# Altium project ctrl_V1.0.PrjPcb
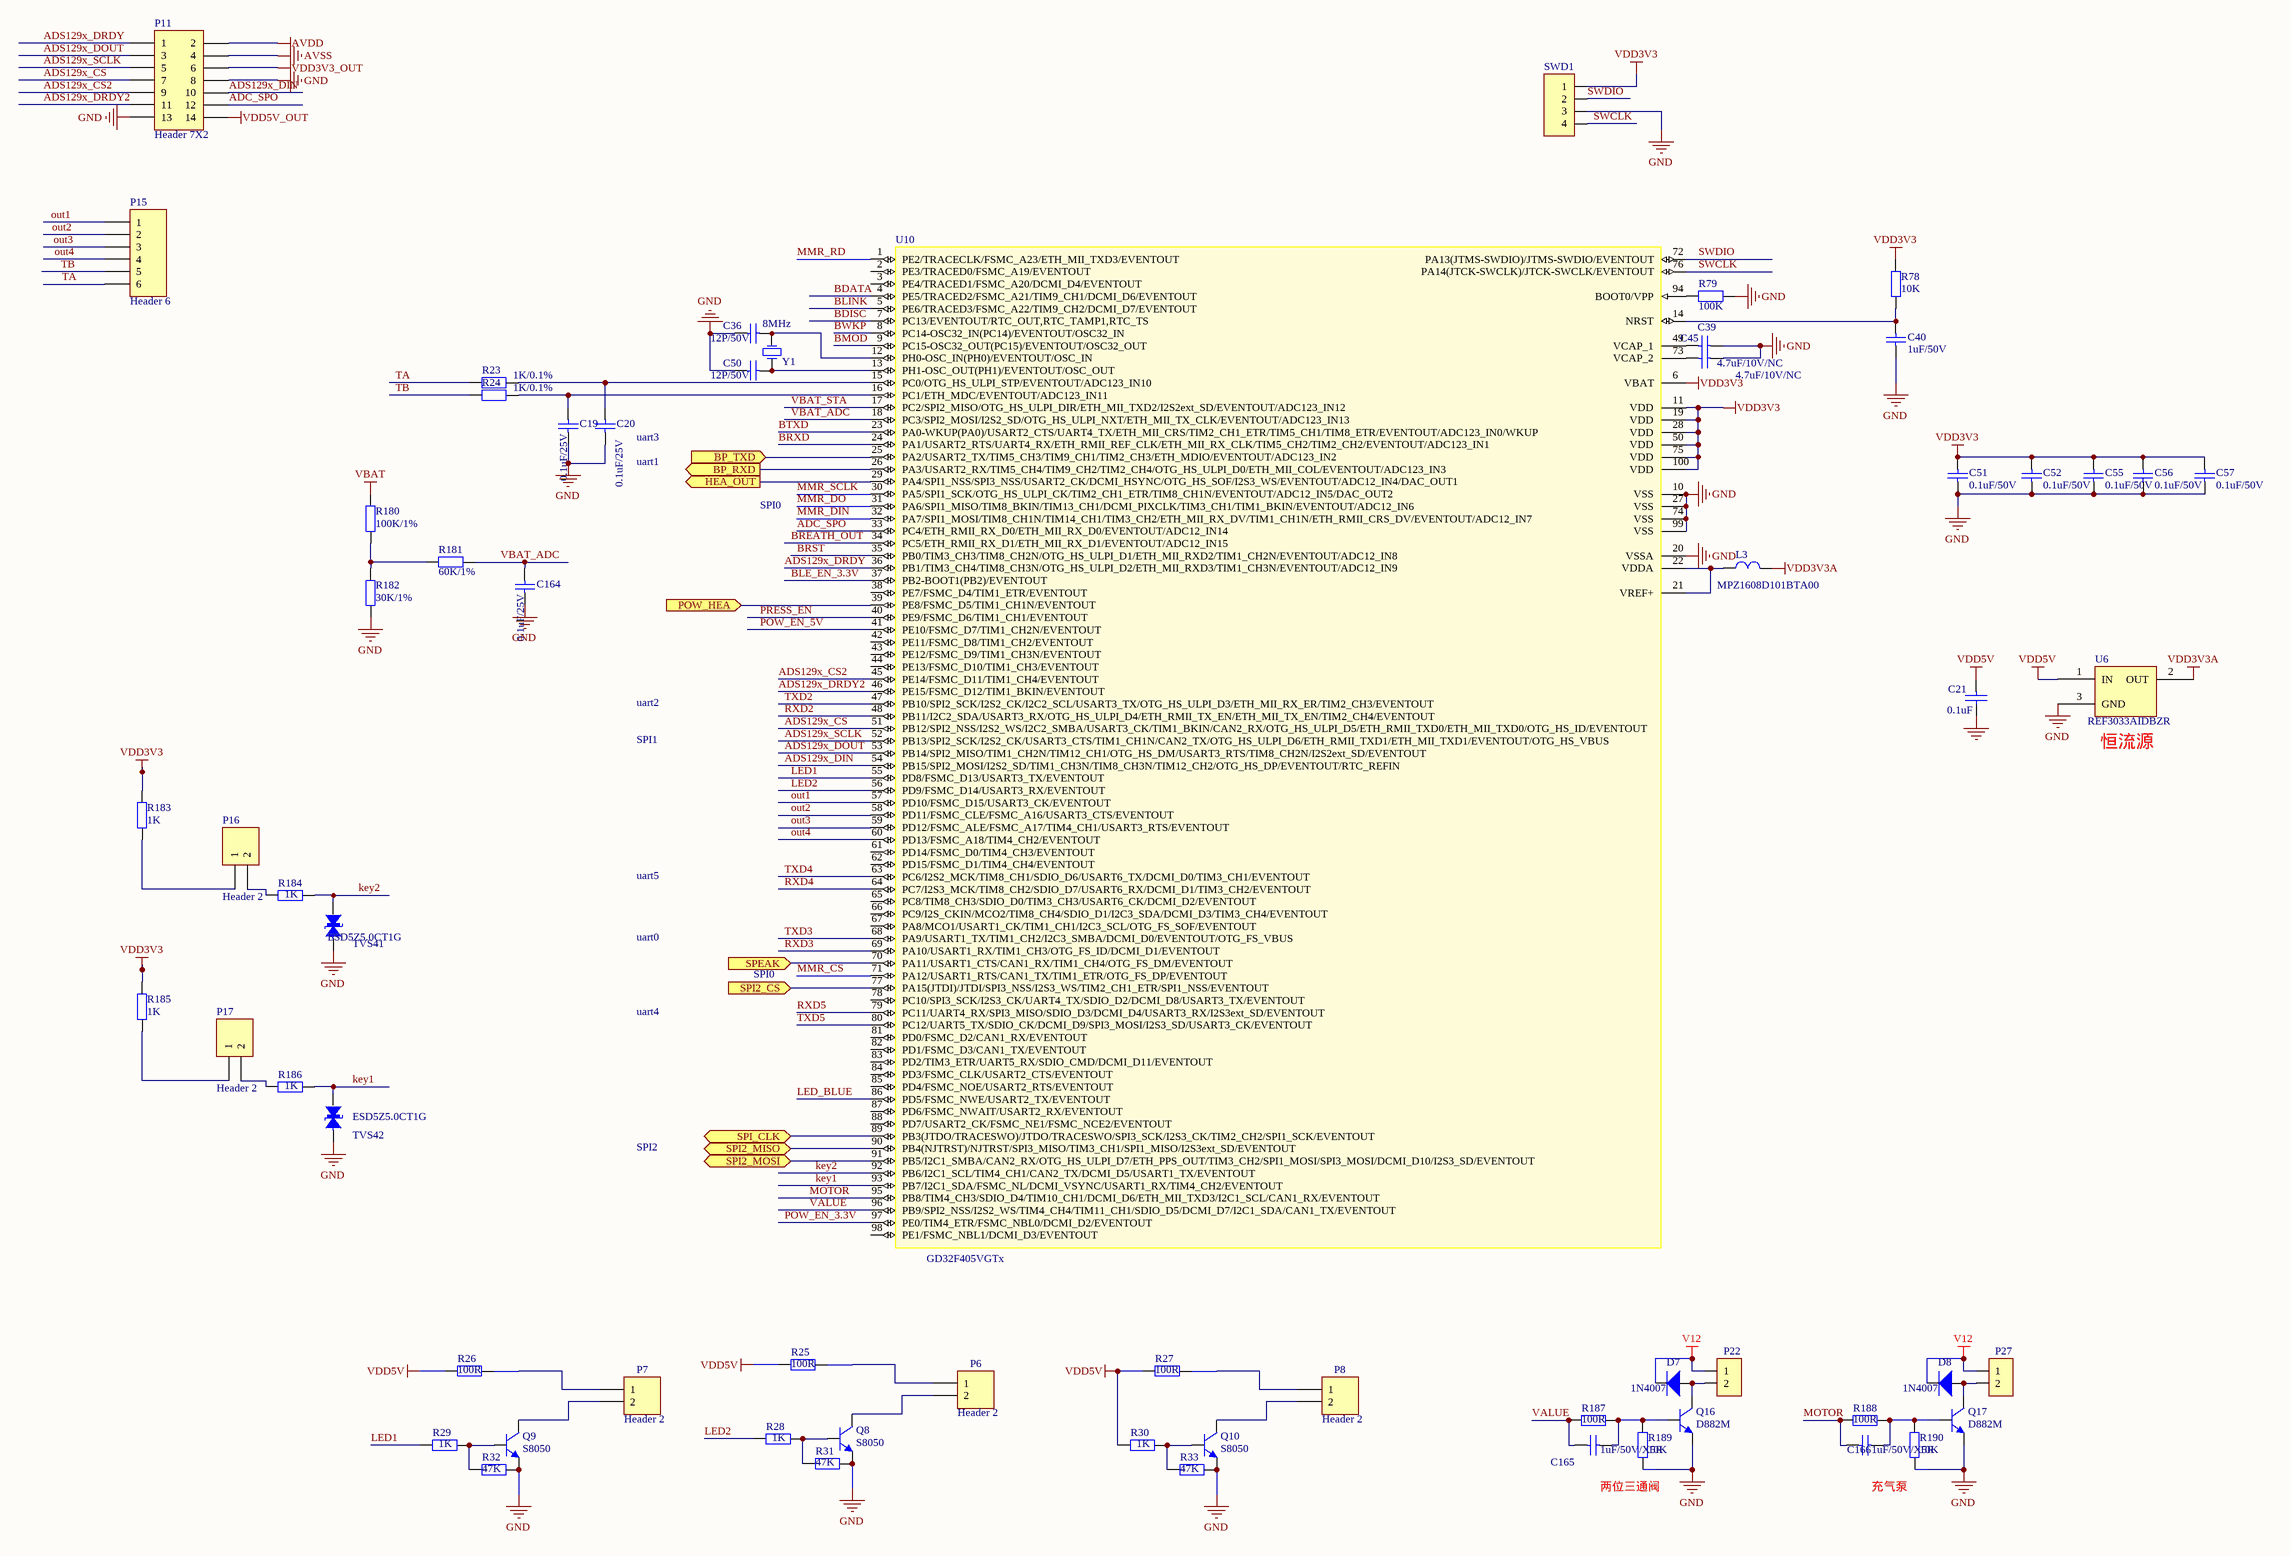
[diagram p0: cpu.SchDoc]
6 sheets, 203 parts. Net scope: global (net labels, ports and power ports of the same name join across sheets).
Board file: ECG_Ctrl_V1.0_ZM_20211208.PcbDoc
Sheets:
  cpu.SchDoc
  BlueToothi.SchDoc
  11_Speak.SchDoc
  02_Power.SchDoc
  Charger.SchDoc
  Sensor.SchDoc

## Sheet cpu.SchDoc
size A2

### Parts
C19  0.1uF/25V  [SMD-0603C]
C20  0.1uF/25V  [SMD-0603C]
C21  0.1uF  [0603C]
C36  12P/50V  [SMD-0603C]
C39  4.7uF/10V/NC  [SMD-0603C]
C40  1uF/50V  [SMD-0603C]
C45  4.7uF/10V/NC  [SMD-0603C]
C50  12P/50V  [SMD-0603C]
C51  0.1uF/50V  [SMD-0603C]
C52  0.1uF/50V  [SMD-0603C]
C55  0.1uF/50V  [SMD-0603C]
C56  0.1uF/50V  [SMD-0603C]
C57  0.1uF/50V  [SMD-0603C]
C164  0.1uF/25V  [SMD-0603C]
C165  1uF/50V/X5R  [SMD-0603C]
C166  1uF/50V/X5R  [SMD-0603C]
D7  1N4007  [DO-214-AC]
D8  1N4007  [DO-214-AC]
L3  MPZ1608D101BTA00  [SMD-0603]
P6  Header 2  [2X2.54MMw]
P7  Header 2  [2X2.54MMw]
P8  Header 2  [2X2.54MMw]
P11  Header 7X2  [HDR2X7]
P15  Header 6  [HDR1X6]
P16  Header 2  [HDR1X2]
P17  Header 2  [HDR1X2]
P22  VH2.54-2P  [2X2.54MMw]  (value not drawn)
P27  VH2.54-2P  [2X2.54MMw]  (value not drawn)
Q8  S8050  [SOT-23]
Q9  S8050  [SOT-23]
Q10  S8050  [SOT-23]
Q16  D882M  [SOT-89-3]
Q17  D882M  [SOT-89-3]
R23  1K/0.1%  [SMD-0603]
R24  1K/0.1%  [SMD-0603]
R25  100R  [0603r]
R26  100R  [0603r]
R27  100R  [0603r]
R28  1K  [SMD-0603]
R29  1K  [SMD-0603]
R30  1K  [SMD-0603]
R31  47K  [SMD-0603]
R32  47K  [SMD-0603]
R33  47K  [SMD-0603]
R78  10K  [SMD-0603]
R79  100K  [SMD-0603]
R180  100K/1%  [SMD-0603]
R181  60K/1%  [SMD-0603]
R182  30K/1%  [SMD-0603]
R183  1K  [SMD-0603]
R184  1K  [SMD-0603]
R185  1K  [SMD-0603]
R186  1K  [SMD-0603]
R187  100R  [SMD-0603]
R188  100R  [SMD-0603]
R189  10K  [SMD-0603]
R190  10K  [SMD-0603]
SWD1  SIP-4 (NC)  [SIP-4]  (value not drawn)
TVS41  ESD5Z5.0CT1G  [SOD-523]
TVS42  ESD5Z5.0CT1G  [SOD-523]
U6  REF3033AIDBZR  [SOT23-3]
U10  GD32F405VGTx  [STM-LQFP100_N]
Y1  8MHz  [XTAL-3225-2]

### Ports
BP_RXD (out), BP_TXD (in), HEA_OUT (out), POW_HEA (in), SPEAK (in), SPI2_CS (in), SPI2_MISO (bidir), SPI2_MOSI (bidir), SPI_CLK (bidir)

### Nets
AVDD: P11.2
AVSS: P11.4
GND: C19.2 C20.2 C21.2 C36.2 C39.1 C40.1 C45.1 C50.2 C51.1 C52.1 C55.1 C56.1 C57.1 C164.2 P11.8 P11.13 Q8.2(E) Q9.2(E) Q10.2(E) Q16.3(E) Q17.3(E) R31.2 R32.2 R33.2 R79.1 R182.2 R189.2 R190.2 SWD1.3 TVS41.2(B) TVS42.2(B) U6.3(GND) U10.10(VSS) U10.20(VSSA) U10.27(VSS) U10.74(VSS) U10.99(VSS)
V12: D7.2(K) D8.2(K) P22.1 P27.1
VBAT: R180.1
VDD3V3: C51.2 C52.2 C55.2 C56.2 C57.2 R78.2 R183.2 R185.2 SWD1.1 U10.6(VBAT) U10.11(VDD) U10.19(VDD) U10.28(VDD) U10.50(VDD) U10.75(VDD) U10.100(VDD)
VDD3V3_OUT: P11.6
VDD3V3A: L3.1 U6.2(OUT)
VDD5V: C21.1 R25.2 R26.2 R27.2 R30.1 U6.1(IN)
VDD5V_OUT: P11.14  [project net V5.0]
ADC_SPO: P11.12 U10.33(PC4/ETH_RMII_RX_D0/ETH_MII_RX_D0/EVENTOUT/ADC12_IN14)
ADS129x_CS: P11.7 U10.51(PB12/SPI2_NSS/I2S2_WS/I2C2_SMBA/USART3_CK/TIM1_BKIN/CAN2_RX/OTG_HS_ULPI_D5/ETH_RMII_TXD0/ETH_MII_TXD0/OTG_HS_ID/EVENTOUT)
ADS129x_CS2: P11.9 U10.45(PE14/FSMC_D11/TIM1_CH4/EVENTOUT)
ADS129x_DIN: P11.10 U10.54(PB15/SPI2_MOSI/I2S2_SD/TIM1_CH3N/TIM8_CH3N/TIM12_CH2/OTG_HS_DP/EVENTOUT/RTC_REFIN)
ADS129x_DOUT: P11.3 U10.53(PB14/SPI2_MISO/TIM1_CH2N/TIM12_CH1/OTG_HS_DM/USART3_RTS/TIM8_CH2N/I2S2ext_SD/EVENTOUT)
ADS129x_DRDY: P11.1 U10.36(PB1/TIM3_CH4/TIM8_CH3N/OTG_HS_ULPI_D2/ETH_MII_RXD3/TIM1_CH3N/EVENTOUT/ADC12_IN9)
ADS129x_DRDY2: P11.11 U10.46(PE15/FSMC_D12/TIM1_BKIN/EVENTOUT)
ADS129x_SCLK: P11.5 U10.52(PB13/SPI2_SCK/I2S2_CK/USART3_CTS/TIM1_CH1N/CAN2_TX/OTG_HS_ULPI_D6/ETH_RMII_TXD1/ETH_MII_TXD1/EVENTOUT/OTG_HS_VBUS)
BDATA: U10.4(PE5/TRACED2/FSMC_A21/TIM9_CH1/DCMI_D6/EVENTOUT)
BDISC: U10.7(PC13/EVENTOUT/RTC_OUT,RTC_TAMP1,RTC_TS)
BLE_EN_3.3V: U10.37(PB2-BOOT1(PB2)/EVENTOUT)
BLINK: U10.5(PE6/TRACED3/FSMC_A22/TIM9_CH2/DCMI_D7/EVENTOUT)
BMOD: U10.9(PC15-OSC32_OUT(PC15)/EVENTOUT/OSC32_OUT)
BREATH_OUT: U10.34(PC5/ETH_RMII_RX_D1/ETH_MII_RX_D1/EVENTOUT/ADC12_IN15)
BRST: U10.35(PB0/TIM3_CH3/TIM8_CH2N/OTG_HS_ULPI_D1/ETH_MII_RXD2/TIM1_CH2N/EVENTOUT/ADC12_IN8)
BRXD: U10.24(PA1/USART2_RTS/UART4_RX/ETH_RMII_REF_CLK/ETH_MII_RX_CLK/TIM5_CH2/TIM2_CH2/EVENTOUT/ADC123_IN1)
BTXD: U10.23(PA0-WKUP(PA0)/USART2_CTS/UART4_TX/ETH_MII_CRS/TIM2_CH1_ETR/TIM5_CH1/TIM8_ETR/EVENTOUT/ADC123_IN0/WKUP)
BWKP: U10.8(PC14-OSC32_IN(PC14)/EVENTOUT/OSC32_IN)
key1: R186.2 TVS42.1(A) U10.93(PB7/I2C1_SDA/FSMC_NL/DCMI_VSYNC/USART1_RX/TIM4_CH2/EVENTOUT)
key2: R184.2 TVS41.1(A) U10.92(PB6/I2C1_SCL/TIM4_CH1/CAN2_TX/DCMI_D5/USART1_TX/EVENTOUT)
LED1: R29.1 U10.55(PD8/FSMC_D13/USART3_TX/EVENTOUT)
LED2: R28.1 U10.56(PD9/FSMC_D14/USART3_RX/EVENTOUT)
LED_BLUE: U10.86(PD5/FSMC_NWE/USART2_TX/EVENTOUT)
MMR_CS: U10.71(PA12/USART1_RTS/CAN1_TX/TIM1_ETR/OTG_FS_DP/EVENTOUT)
MMR_DIN: U10.32(PA7/SPI1_MOSI/TIM8_CH1N/TIM14_CH1/TIM3_CH2/ETH_MII_RX_DV/TIM1_CH1N/ETH_RMII_CRS_DV/EVENTOUT/ADC12_IN7)
MMR_DO: U10.31(PA6/SPI1_MISO/TIM8_BKIN/TIM13_CH1/DCMI_PIXCLK/TIM3_CH1/TIM1_BKIN/EVENTOUT/ADC12_IN6)
MMR_RD: U10.1(PE2/TRACECLK/FSMC_A23/ETH_MII_TXD3/EVENTOUT)
MMR_SCLK: U10.30(PA5/SPI1_SCK/OTG_HS_ULPI_CK/TIM2_CH1_ETR/TIM8_CH1N/EVENTOUT/ADC12_IN5/DAC_OUT2)
MOTOR: C166.2 R188.2 U10.95(PB8/TIM4_CH3/SDIO_D4/TIM10_CH1/DCMI_D6/ETH_MII_TXD3/I2C1_SCL/CAN1_RX/EVENTOUT)
out1: P15.1 U10.57(PD10/FSMC_D15/USART3_CK/EVENTOUT)
out2: P15.2 U10.58(PD11/FSMC_CLE/FSMC_A16/USART3_CTS/EVENTOUT)
out3: P15.3 U10.59(PD12/FSMC_ALE/FSMC_A17/TIM4_CH1/USART3_RTS/EVENTOUT)
out4: P15.4 U10.60(PD13/FSMC_A18/TIM4_CH2/EVENTOUT)
POW_EN_3.3V: U10.97(PE0/TIM4_ETR/FSMC_NBL0/DCMI_D2/EVENTOUT)
POW_EN_5V: U10.41(PE10/FSMC_D7/TIM1_CH2N/EVENTOUT)
PRESS_EN: U10.40(PE9/FSMC_D6/TIM1_CH1/EVENTOUT)
RXD2: U10.48(PB11/I2C2_SDA/USART3_RX/OTG_HS_ULPI_D4/ETH_RMII_TX_EN/ETH_MII_TX_EN/TIM2_CH4/EVENTOUT)
RXD3: U10.69(PA10/USART1_RX/TIM1_CH3/OTG_FS_ID/DCMI_D1/EVENTOUT)
RXD4: U10.64(PC7/I2S3_MCK/TIM8_CH2/SDIO_D7/USART6_RX/DCMI_D1/TIM3_CH2/EVENTOUT)
RXD5: U10.79(PC11/UART4_RX/SPI3_MISO/SDIO_D3/DCMI_D4/USART3_RX/I2S3ext_SD/EVENTOUT)
SWCLK: SWD1.4 U10.76(PA14(JTCK-SWCLK)/JTCK-SWCLK/EVENTOUT)
SWDIO: SWD1.2 U10.72(PA13(JTMS-SWDIO)/JTMS-SWDIO/EVENTOUT)
TA: P15.6 R23.2
TB: P15.5 R24.2
TXD2: U10.47(PB10/SPI2_SCK/I2S2_CK/I2C2_SCL/USART3_TX/OTG_HS_ULPI_D3/ETH_MII_RX_ER/TIM2_CH3/EVENTOUT)
TXD3: U10.68(PA9/USART1_TX/TIM1_CH2/I2C3_SMBA/DCMI_D0/EVENTOUT/OTG_FS_VBUS)
TXD4: U10.63(PC6/I2S2_MCK/TIM8_CH1/SDIO_D6/USART6_TX/DCMI_D0/TIM3_CH1/EVENTOUT)
TXD5: U10.80(PC12/UART5_TX/SDIO_CK/DCMI_D9/SPI3_MOSI/I2S3_SD/USART3_CK/EVENTOUT)
VALUE: C165.2 R187.2 U10.96(PB9/SPI2_NSS/I2S2_WS/TIM4_CH4/TIM11_CH1/SDIO_D5/DCMI_D7/I2C1_SDA/CAN1_TX/EVENTOUT)
VBAT_ADC: C164.1 R181.2 U10.18(PC3/SPI2_MOSI/I2S2_SD/OTG_HS_ULPI_NXT/ETH_MII_TX_CLK/EVENTOUT/ADC123_IN13)
VBAT_STA: U10.17(PC2/SPI2_MISO/OTG_HS_ULPI_DIR/ETH_MII_TXD2/I2S2ext_SD/EVENTOUT/ADC123_IN12)
NetC19_1: C19.1 R24.1 U10.16(PC1/ETH_MDC/EVENTOUT/ADC123_IN11)
NetC20_1: C20.1 R23.1 U10.15(PC0/OTG_HS_ULPI_STP/EVENTOUT/ADC123_IN10)
NetC36_1: C36.1 U10.12(PH0-OSC_IN(PH0)/EVENTOUT/OSC_IN) Y1.2(OSC2)
NetC39_2: C39.2 U10.49(VCAP_1)
NetC40_2: C40.2 R78.1 U10.14(NRST)
NetC45_2: C45.2 U10.73(VCAP_2)
NetC50_1: C50.1 U10.13(PH1-OSC_OUT(PH1)/EVENTOUT/OSC_OUT) Y1.1(OSC1)
NetC165_1: C165.1 Q16.1(B) R187.1 R189.1
NetC166_1: C166.1 Q17.1(B) R188.1 R190.1
NetD7_1: D7.1(A) P22.2 Q16.2(C)
NetD8_1: D8.1(A) P27.2 Q17.2(C)
NetL3_2: L3.2 U10.21(VREF+) U10.22(VDDA)
NetP6_1: P6.1 R25.1
NetP6_2: P6.2 Q8.3(C)
NetP7_1: P7.1 R26.1
NetP7_2: P7.2 Q9.3(C)
NetP8_1: P8.1 R27.1
NetP8_2: P8.2 Q10.3(C)
NetP14_2: U10.29(PA4/SPI1_NSS/SPI3_NSS/USART2_CK/DCMI_HSYNC/OTG_HS_SOF/I2S3_WS/EVENTOUT/ADC12_IN4/DAC_OUT1) ; port HEA_OUT
NetP14_3: U10.39(PE8/FSMC_D5/TIM1_CH1N/EVENTOUT) ; port POW_HEA
NetP16_1: P16.1 R183.1
NetP16_2: P16.2 R184.1
NetP17_1: P17.1 R185.1
NetP17_2: P17.2 R186.1
NetQ8_1: Q8.1(B) R28.2 R31.1
NetQ9_1: Q9.1(B) R29.2 R32.1
NetQ10_1: Q10.1(B) R30.2 R33.1
NetQ13_2: U10.25(PA2/USART2_TX/TIM5_CH3/TIM9_CH1/TIM2_CH3/ETH_MDIO/EVENTOUT/ADC123_IN2) ; port BP_TXD
NetQ15_3: U10.26(PA3/USART2_RX/TIM5_CH4/TIM9_CH2/TIM2_CH4/OTG_HS_ULPI_D0/ETH_MII_COL/EVENTOUT/ADC123_IN3) ; port BP_RXD
NetR57_1: U10.70(PA11/USART1_CTS/CAN1_RX/TIM1_CH4/OTG_FS_DM/EVENTOUT) ; port SPEAK
NetR79_2: R79.2 U10.94(BOOT0/VPP)
NetR180_2: R180.2 R181.1 R182.1
NetU10_77: U10.77(PA15(JTDI)/JTDI/SPI3_NSS/I2S3_WS/TIM2_CH1_ETR/SPI1_NSS/EVENTOUT) ; port SPI2_CS
NetU10_89: U10.89(PB3(JTDO/TRACESWO)/JTDO/TRACESWO/SPI3_SCK/I2S3_CK/TIM2_CH2/SPI1_SCK/EVENTOUT) ; port SPI_CLK
NetU10_90: U10.90(PB4(NJTRST)/NJTRST/SPI3_MISO/TIM3_CH1/SPI1_MISO/I2S3ext_SD/EVENTOUT) ; port SPI2_MISO
NetU10_91: U10.91(PB5/I2C1_SMBA/CAN2_RX/OTG_HS_ULPI_D7/ETH_PPS_OUT/TIM3_CH2/SPI1_MOSI/SPI3_MOSI/DCMI_D10/I2S3_SD/EVENTOUT) ; port SPI2_MOSI

Not connected (* = marked no-connect by the designer): U10 2(PE3/TRACED0/FSMC_A19/EVENTOUT) 3(PE4/TRACED1/FSMC_A20/DCMI_D4/EVENTOUT) 38(PE7/FSMC_D4/TIM1_ETR/EVENTOUT) 42(PE11/FSMC_D8/TIM1_CH2/EVENTOUT) 43(PE12/FSMC_D9/TIM1_CH3N/EVENTOUT) 44(PE13/FSMC_D10/TIM1_CH3/EVENTOUT) 61(PD14/FSMC_D0/TIM4_CH3/EVENTOUT) 62(PD15/FSMC_D1/TIM4_CH4/EVENTOUT) 65(PC8/TIM8_CH3/SDIO_D0/TIM3_CH3/USART6_CK/DCMI_D2/EVENTOUT) 66(PC9/I2S_CKIN/MCO2/TIM8_CH4/SDIO_D1/I2C3_SDA/DCMI_D3/TIM3_CH4/EVENTOUT) 67(PA8/MCO1/USART1_CK/TIM1_CH1/I2C3_SCL/OTG_FS_SOF/EVENTOUT) 78(PC10/SPI3_SCK/I2S3_CK/UART4_TX/SDIO_D2/DCMI_D8/USART3_TX/EVENTOUT) 81(PD0/FSMC_D2/CAN1_RX/EVENTOUT) 82(PD1/FSMC_D3/CAN1_TX/EVENTOUT) 83(PD2/TIM3_ETR/UART5_RX/SDIO_CMD/DCMI_D11/EVENTOUT) 84(PD3/FSMC_CLK/USART2_CTS/EVENTOUT) 85(PD4/FSMC_NOE/USART2_RTS/EVENTOUT) 87(PD6/FSMC_NWAIT/USART2_RX/EVENTOUT) 88(PD7/USART2_CK/FSMC_NE1/FSMC_NCE2/EVENTOUT) 98(PE1/FSMC_NBL1/DCMI_D3/EVENTOUT)

### Notes on the sheet
- (near C20) uart1
- (near C20) uart3
- SPI0
- uart2
- SPI1
- (near U6) 恒流源
- uart5
- uart0
- uart4
- SPI2
- 两位三通阀
- 充气泵

### Library data of the parts
C19 C20 C36 C50 C164 = CAP4: 贴片电容 5%
C21 = CAP: Capacitor
C39 C40 C45 C51 C52 C55-C57 C165 C166 = CAP4: 贴片电容 20%
D7 D8 = DIODE2: 二极管 M7
L3 = CIZHU1: 磁珠电感 100R 100MHz
P6-P8 P16 P17 = Header 2: Header, 2-Pin; LatestRevisionDate: 17-Jul-2002; LatestRevisionNote: Re-released for DXP Platform.; Publisher: Altium Limited
P11 = Header 7X2: Header, 7-Pin, Dual row; LatestRevisionDate: 17-Jul-2002; LatestRevisionNote: Re-released for DXP Platform.; Publisher: Altium Limited
P15 = Header 6: Header, 6-Pin; LatestRevisionDate: 17-Jul-2002; LatestRevisionNote: Re-released for DXP Platform.; Publisher: Altium Limited
P22 P27 = SIP-2: 2.54mm- 2P立贴
Q8-Q10 = NPN-1: NPN
Q16 Q17 = NPN-TO252: NPN TO252
R23 R24 = R: 贴片电阻 1%
R25-R33 = RES0: 贴片电阻 5%
R78 R79 R180-R182 = RES2: 贴片电阻 5%
R183-R186 = R: 贴片电阻 5%
R187-R190 = RES-SOP: 贴片电阻 5%
SWD1 = SIP-4: ISP 下载
TVS41 TVS42 = TVS-1: ESD二极管
U6 = REF3012
U10 = STM32F405VGTx: Manufacturer: STMicroelectronics; PartNumber: STM32F405VGT6; Core: ARM Cortex-M4; D/A Converter: 2x12-bit; FLASH Size (Prog) (kB): 1024; I/Os (High Current): 82; Internal RAM Size (kB): 192; Operating Frequency(F) (Processor speed) (MHz): 168; Packing: Tray; Supply Voltage(Vcc) max (V): 3.6; Supply Voltage(Vcc) min (V): 1.8; DatasheetVersion: Rev. 4; PackageVersion: Rev. 1, 06/2013; PackageReference: LQFP100; PackageDescription: 100-Pin Low Profile Quad Flat Package, 14 x 14 mm Body, 0.5 mm Pitch; Mounting Technology: Surface Mount; ComponentLink1Description: Manufacturer URL; ComponentLink1URL: http://www.st.com/web/en/home.html; ComponentLink2Description: Datasheet; ComponentLink2URL: http://www.st.com/st-web-ui/static/active/en/resource/technical/document/datasheet/DM00037051.pdf; ComponentLink3Description: Package Specification; ComponentLink3URL: http://www.st.com/st-web-ui/static/active/en/resource/technical/document/data_brief/DM00071938.pdf
Y1 = XTAL: 3225 贴片晶振

## Sheet BlueToothi.SchDoc
size A4
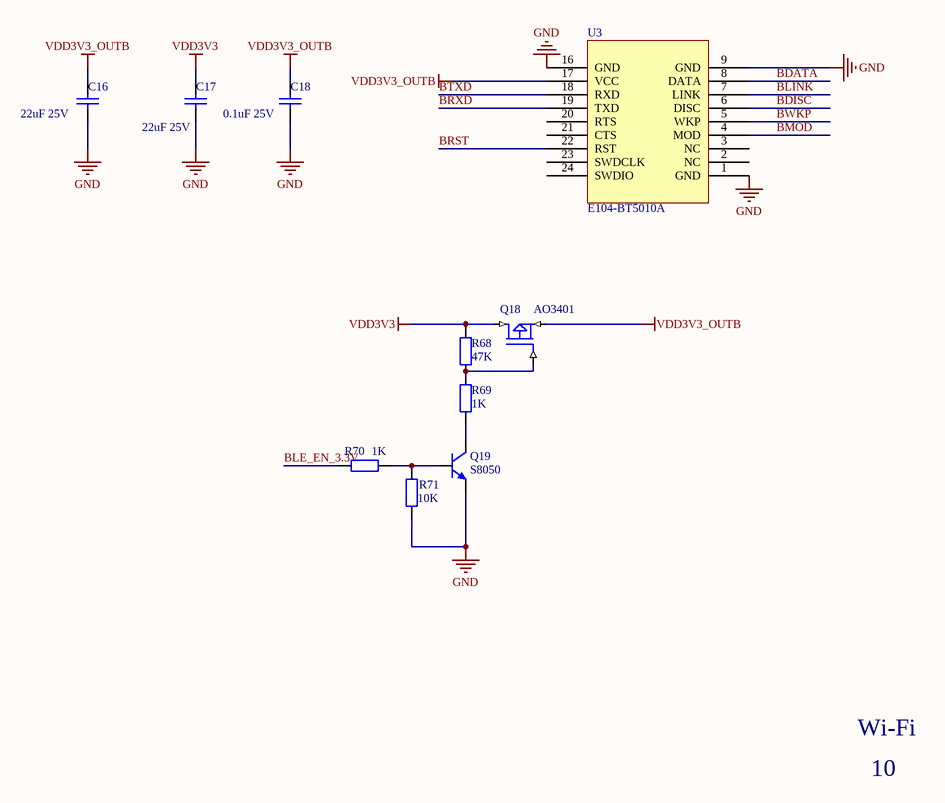
[diagram p1: BlueToothi.SchDoc]

### Parts
C16  22uF 25V  [SMD-0805C]
C17  22uF 25V  [SMD-0805C]
C18  0.1uF 25V  [SMD-0805C]
Q18  AO3401  [SOT-23]
Q19  S8050  [SOT-23]
R68  47K  [SMD-0603]
R69  1K  [SMD-0603]
R70  1K  [SMD-0603]
R71  10K  [SMD-0603]
U3  E104-BT5010A  [E104-BT503]

### Nets
GND: C16.1 C17.1 C18.1 Q19.2(E) R71.1 U3.1(GND) U3.9(GND) U3.16(GND)
VDD3V3: C17.2 Q18.2(D) R68.1
VDD3V3_OUTB: C16.2 C18.2 Q18.3(S) U3.17(VCC)
BDATA: U3.8(DATA)
BDISC: U3.6(DISC)
BLE_EN_3.3V: R70.1
BLINK: U3.7(LINK)
BMOD: U3.4(MOD)
BRST: U3.22(RST)
BRXD: U3.19(TXD)
BTXD: U3.18(RXD)
BWKP: U3.5(WKP)
NetQ18_1: Q18.1(G) R68.2 R69.2
NetQ19_1: Q19.1(B) R70.2 R71.2
NetQ19_3: Q19.3(C) R69.1

Not connected (* = marked no-connect by the designer): U3 2(NC) 3(NC) 20(RTS) 21(CTS) 23(SWDCLK) 24(SWDIO)

### Notes on the sheet
- Wi-Fi
- 10

### Library data of the parts
C16-C18 = CAP4: 贴片电容 20%
Q18 = MOSFET P
Q19 = NPN-1: NPN
R68-R71 = R: 贴片电阻 5%
U3 = E104-BT503

## Sheet 11_Speak.SchDoc
size A4
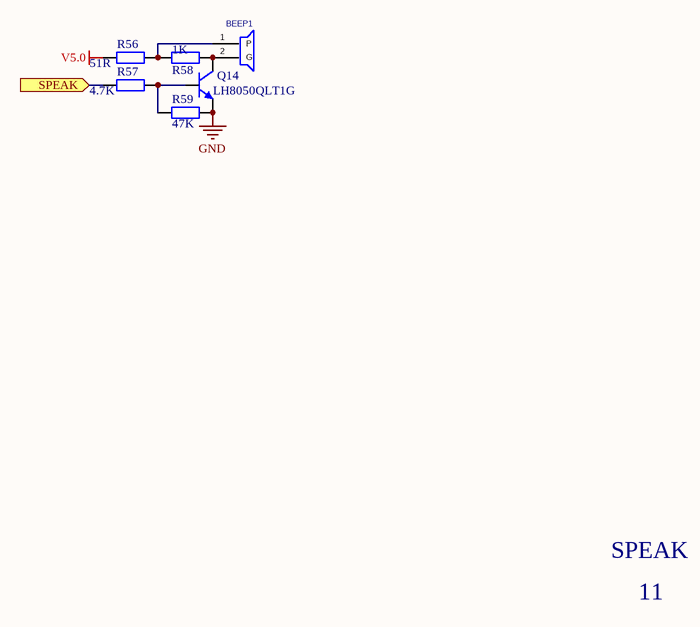
[diagram p2: 11_Speak.SchDoc]

### Parts
BEEP1  BEEP-9.5X5.5  [BEEP-9.5X5.5]  (value not drawn)
Q14  LH8050QLT1G  [SOT-23]
R56  51R  [SMD-0603]
R57  4.7K  [SMD-0603]
R58  1K  [SMD-0603]
R59  47K  [SMD-0603]

### Ports
SPEAK (in)

### Nets
GND: Q14.2(E) R59.2
V5.0: R56.2
NetBEEP1_1: BEEP1.1(P) R56.1 R58.2
NetBEEP1_2: BEEP1.2(G) Q14.3(C) R58.1
NetQ14_1: Q14.1(B) R57.2 R59.1
NetR57_1: R57.1 ; port SPEAK

### Notes on the sheet
- SPEAK
- 11

### Library data of the parts
Q14 = NPN-1: NPN
R56-R59 = RES0: 贴片电阻 5%
BEEP1 = BEEP-9.5X5.5: PCB DECAL: BEEP-9.5X5.5

## Sheet 02_Power.SchDoc
size A3
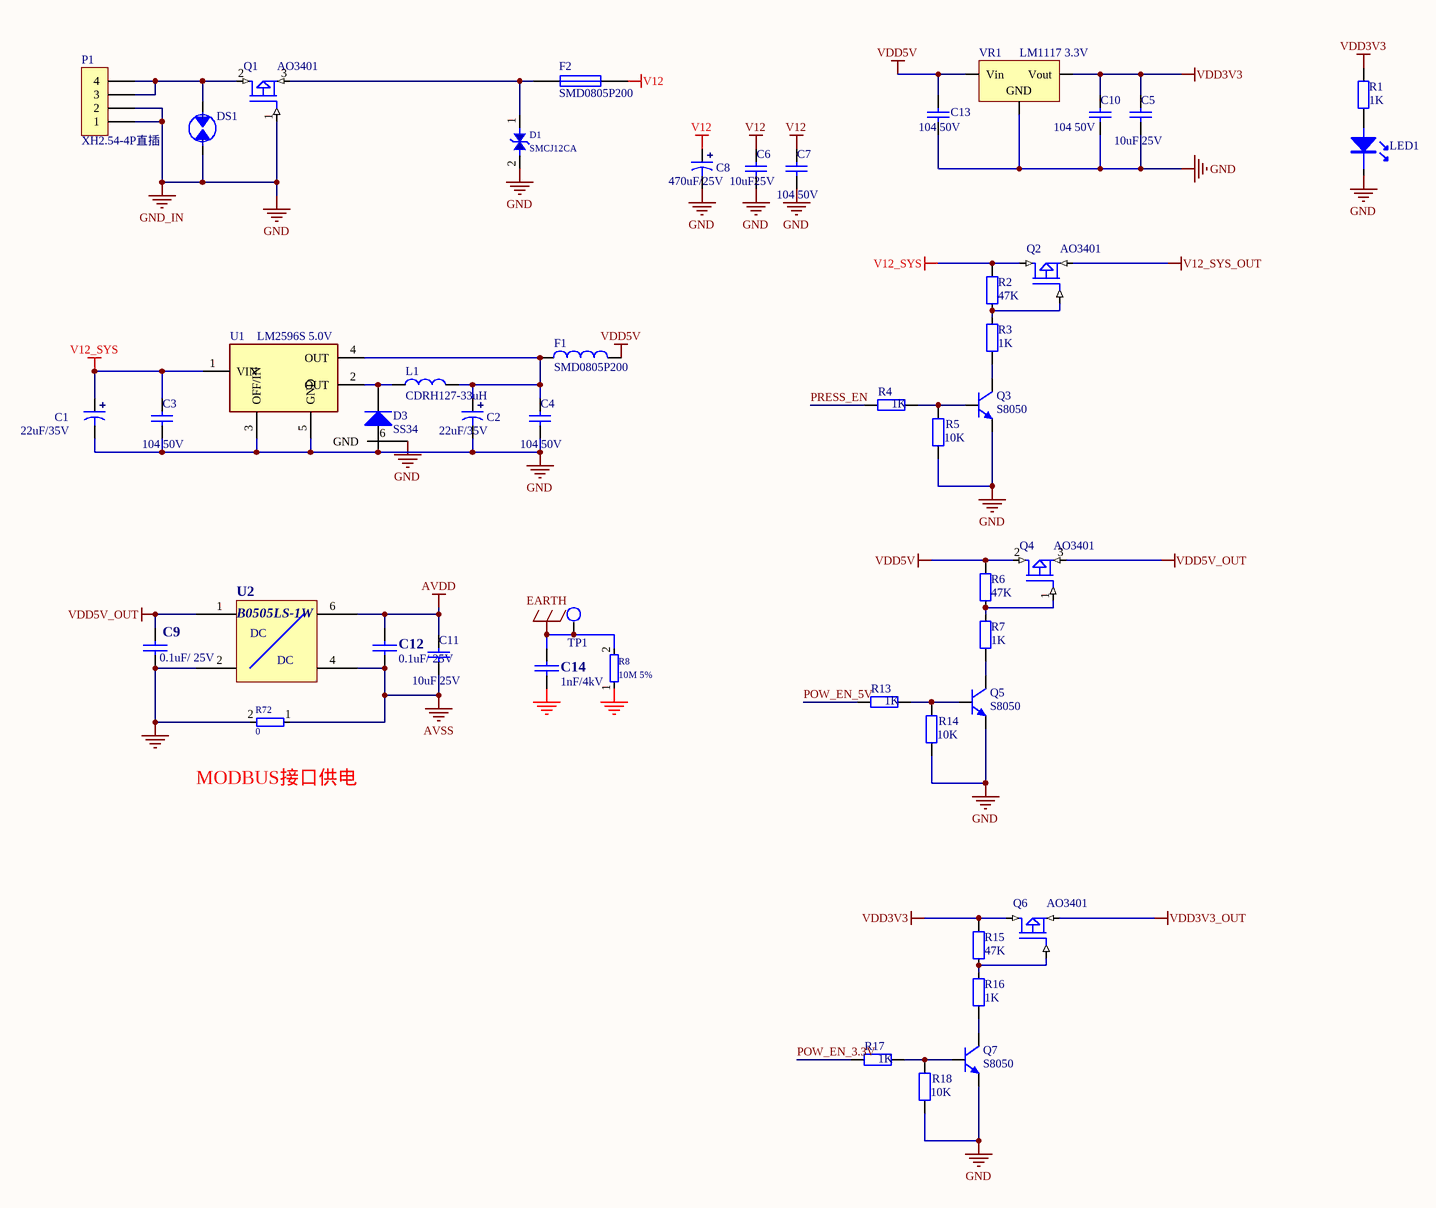
[diagram p3: 02_Power.SchDoc]

### Parts
C1  22uF/35V  [1206C]
C2  22uF/35V  [1206C]
C3  104 50V  [SMD-0805C]
C4  104 50V  [SMD-0805C]
C5  10uF 25V  [SMD-0603C]
C6  10uF25V  [SMD-0603C]
C7  104 50V  [SMD-0603C]
C8  470uF/25V  [8*12]
C9  0.1uF/ 25V  [0603C]
C10  104 50V  [SMD-0603C]
C11  10uF 25V  [SMD-0603C]
C12  0.1uF/ 25V  [0603C]
C13  104 50V  [SMD-0603C]
C14  1nF/4kV  [CY1]
D1  SMCJ12CA  [SMC]
D3  SS34  [SMA]
DS1  UN1812-90CSMD  [SMD-1812]  (value not drawn)
F1  SMD0805P200  [0805r]
F2  SMD0805P200  [0805R]
L1  CDRH127-33uH  [CDRH-127]
LED1  蓝光 3528  [SMD-0603D]  (value not drawn)
P1  XH2.54-4P直插  [4X2.54MMW]
Q1  AO3401  [SOT-23]
Q2  AO3401  [SOT-23]
Q3  S8050  [SOT-23]
Q4  AO3401  [SOT-23]
Q5  S8050  [SOT-23]
Q6  AO3401  [SOT-23]
Q7  S8050  [SOT-23]
R1  1K  [SMD-0603]
R2  47K  [SMD-0603]
R3  1K  [SMD-0603]
R4  1K  [SMD-0603]
R5  10K  [SMD-0603]
R6  47K  [SMD-0603]
R7  1K  [SMD-0603]
R8  10M 5%  [1206r]
R13  1K  [SMD-0603]
R14  10K  [SMD-0603]
R15  47K  [SMD-0603]
R16  1K  [SMD-0603]
R17  1K  [SMD-0603]
R18  10K  [SMD-0603]
R72  0  [1206r]
TP1  TPS  [tpd]  (value not drawn)
U1  LM2596S 5.0V  [TO-263-5]
U2  B0505LS-1W  [HKSXXXXB-1W]
VR1  LM1117 3.3V  [SOT223]

### Nets
AVDD: C11.2 C12.1 U2.6
AVSS: C11.1 C12.2 R72.1 U2.4
EARTH: C14.1 R8.2 TP1.1
GND: C1.2 C2.2 C3.1 C4.1 C5.1 C6.1 C7.1 C8.2 C9.2 C10.1 C13.1 C14.2 D1.2 D3.1(A) DS1.2 LED1.2 P1.1 P1.2 Q1.1(G) Q3.2(E) Q5.2(E) Q7.2(E) R5.1 R8.1 R14.1 R18.1 R72.2 U1.3(OFF/IN) U1.5(GND) U1.6(GND) U2.2 VR1.1(GND)  [also labelled GND_IN]
V12: C6.2 C7.2 C8.1 F2.2
V12_SYS: C1.1 C3.2 Q2.2(D) R2.1 U1.1(VIN)
V12_SYS_OUT: Q2.3(S)
VDD3V3: C5.2 C10.2 Q6.2(D) R1.1 R15.1 VR1.2(Vout)
VDD3V3_OUT: Q6.3(S)
VDD5V: C13.2 F1.2 Q4.2(D) R6.1 VR1.3(Vin)
VDD5V_OUT: C9.1 Q4.3(S) U2.1  [project net V5.0]
POW_EN_3.3V: R17.1
POW_EN_5V: R13.1
PRESS_EN: R4.1
NetC2_1: C2.1 C4.2 F1.1 L1.2 U1.4(OUT)
NetD1_1: D1.1 F2.1 Q1.3(S)
NetD3_2: D3.2(K) L1.1 U1.2(OUT)
NetDS1_1: DS1.1 P1.3 P1.4 Q1.2(D)
NetLED1_1: LED1.1 R1.2
NetQ2_1: Q2.1(G) R2.2 R3.2
NetQ3_1: Q3.1(B) R4.2 R5.2
NetQ3_3: Q3.3(C) R3.1
NetQ4_1: Q4.1(G) R6.2 R7.2
NetQ5_1: Q5.1(B) R13.2 R14.2
NetQ5_3: Q5.3(C) R7.1
NetQ6_1: Q6.1(G) R15.2 R16.2
NetQ7_1: Q7.1(B) R17.2 R18.2
NetQ7_3: Q7.3(C) R16.1

### Notes on the sheet
- (near R72) MODBUS接口供电
- (in symbol B0505S) DC

### Library data of the parts
C1 C2 C8 = CAP2: 电解电容
C3 C4 C10 C13 = CAP4: 贴片电容 10%
C5-C7 C11 = CAP4: 贴片电容 20%
C9 C12 C14 = CAP: Capacitor
D1 = D_ESD
D3 = DIODE
DS1 = DISCHARE-1: 气体放电管 90V
F1 = Inductor: Code_IEC: 1005; Value: 10mH; Published: 8-Jun-2000; LatestRevisionDate: 29-May-2009; LatestRevisionNote: IPC-7351 Footprint Added.; PackageReference: 0402-A; Publisher: Altium Limited; PackageDescription: Chip Inductor; Code_JEITA: 0402
F2 = Fuse 1: Fuse; Published: 8-Jun-2000; LatestRevisionDate: 17-Jul-2002; LatestRevisionNote: Re-released for DXP Platform.; PackageReference: PIN-W2/E2.8; Publisher: Altium Limited; PackageDescription: Thru-Hole; 2 Leads
L1 = IND
LED1 = LED0: LED 3528 蓝
P1 = SIP-4
Q1 Q2 Q4 Q6 = MOSFET P
Q3 Q5 Q7 = NPN-1: NPN
R1-R7 R13-R18 = R: 贴片电阻 5%
R8 R72 = RES
U1 = LM2596
U2 = B0505S
VR1 = LM1117: 三端稳压器

## Sheet Charger.SchDoc
size A3
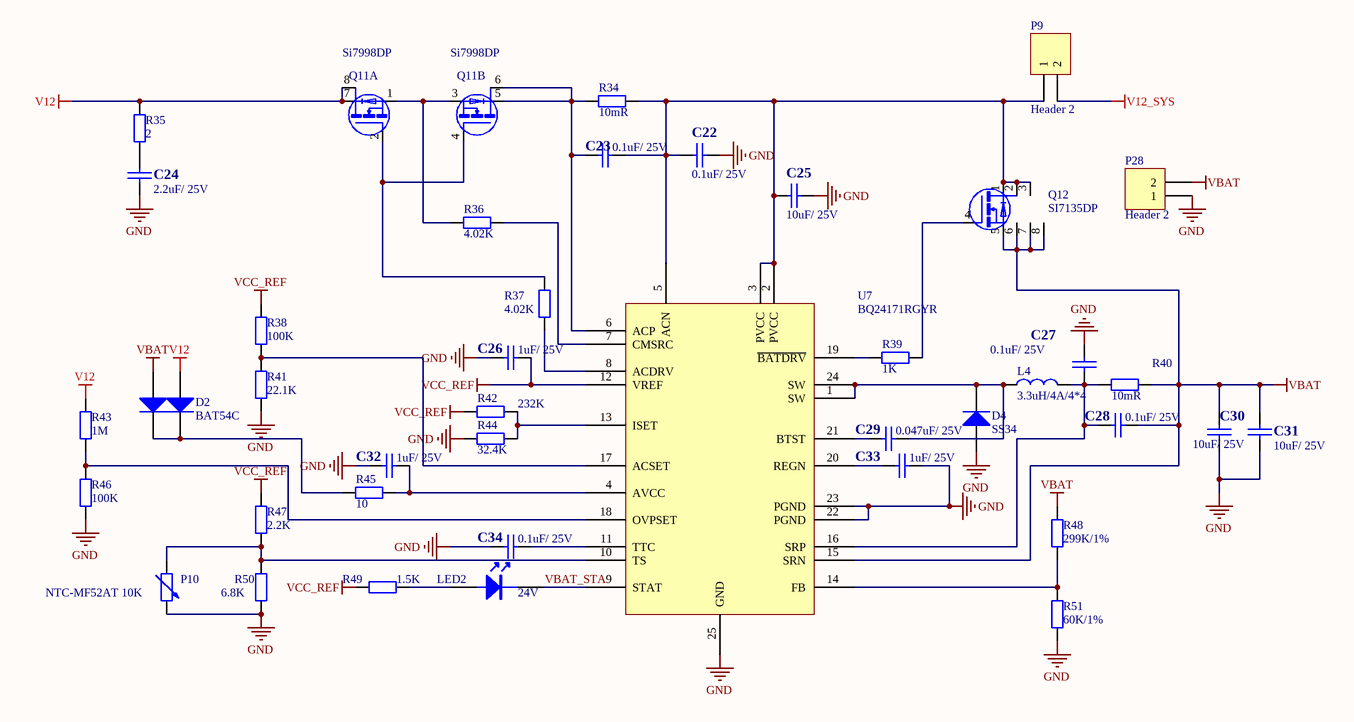
[diagram p4: Charger.SchDoc]

### Parts
C22  0.1uF/ 25V  [0603C]
C23  0.1uF/ 25V  [0603C]
C24  2.2uF/ 25V  [0603C]
C25  10uF/ 25V  [0603C]
C26  1uF/ 25V  [0603C]
C27  0.1uF/ 25V  [0603C]
C28  0.1uF/ 25V  [0603C]
C29  0.047uF/ 25V  [0603C]
C30  10uF/ 25V  [0603C]
C31  10uF/ 25V  [0603C]
C32  1uF/ 25V  [0603C]
C33  1uF/ 25V  [0603C]
C34  0.1uF/ 25V  [0603C]
D2  BAT54C  [SOT23-3]
D4  SS34  [SMA]
L4  3.3uH/4A/4*4  [INDUCTOR_4X4X2]
LED2  24V  [0603LED]
P9  Header 2  [HDR1X2]
P10  NTC-MF52AT 10K  [SMD-0603]
P28  Header 2  [2X2.54MMW]
Q11  Si7998DP  [Si7998DP]  (parts A,B of 2)
Q12  SI7135DP  [PowerPAK SO-8]
R34  10mR  [2512R]
R35  2  [SMD-0603]
R36  4.02K  [SMD-0603]
R37  4.02K  [SMD-0603]
R38  100K  [SMD-0603]
R39  1K  [0603R]
R40  10mR  [2512R]
R41  22.1K  [SMD-0603]
R42  232K  [SMD-0603]
R43  1M  [SMD-0603]
R44  32.4K  [SMD-0603]
R45  10  [SMD-0603]
R46  100K  [SMD-0603]
R47  2.2K  [SMD-0603]
R48  299K/1%  [SMD-0603]
R49  1.5K  [SMD-0603]
R50  6.8K  [SMD-0603]
R51  60K/1%  [SMD-0603]
U7  BQ24171RGYR  [bq24171]

### Nets
GND: C22.2 C24.2 C25.2 C26.2 C27.1 C30.2 C31.2 C32.2 C33.1 C34.2 D4.1(A) P10.2 P28.1 R41.1 R44.1 R46.1 R50.1 R51.2 U7.22(PGND) U7.23(PGND) U7.25(GND)
V12: D2.1(A) Q11.7(D1) Q11.8(D1) R35.2 R43.2
V12_SYS: P9.2
VBAT: C28.1 C30.1 C31.1 D2.2(A) P28.2 Q12.5(D) Q12.6(D) Q12.7(D) Q12.8(D) R40.2 R48.1 U7.15(SRN)
VCC_REF: C26.1 R38.2 R42.1 R47.2 R49.1 U7.12(VREF)
VBAT_STA: LED2.2 U7.9(STAT)
NetC22_1: C22.1 C23.2 C25.1 P9.1 Q12.1(S) Q12.2(S) Q12.3(S) R34.2 U7.2(PVCC) U7.3(PVCC) U7.5(ACN)
NetC23_1: C23.1 Q11.5(D2) Q11.6(D2) R34.1 U7.6(ACP)
NetC24_1: C24.1 R35.1
NetC27_2: C27.2 C28.2 L4.2 R40.1 U7.16(SRP)
NetC29_1: C29.1 D4.2(K) L4.1 U7.1(SW) U7.24(SW)
NetC29_2: C29.2 U7.21(BTST)
NetC32_1: C32.1 R45.2 U7.4(AVCC)
NetC33_2: C33.2 U7.20(REGN)
NetC34_1: C34.1 U7.11(TTC)
NetD2_3: D2.3(K) R45.1
NetLED2_1: LED2.1 R49.2
NetP10_1: P10.1 R47.1 R50.2 U7.10(TS)
NetQ11_1: Q11.1(S1) Q11.3(S2) R36.1
NetQ11_2: Q11.2(G1) Q11.4(G2) R37.2
NetQ12_4: Q12.4(G1) R39.2
NetR36_2: R36.2 U7.7(CMSRC)
NetR37_1: R37.1 U7.8(ACDRV)
NetR38_1: R38.1 R41.2 U7.17(ACSET)
NetR39_1: R39.1 U7.19(~{BATDRV})
NetR42_2: R42.2 R44.2 U7.13(ISET)
NetR43_1: R43.1 R46.2 U7.18(OVPSET)
NetR48_2: R48.2 R51.1 U7.14(FB)

### Library data of the parts
C22-C34 = CAP: Capacitor
D4 = DIODE
L4 = IND
LED2 = LED
P9 P28 = Header 2: Header, 2-Pin; LatestRevisionDate: 17-Jul-2002; LatestRevisionNote: Re-released for DXP Platform.; Publisher: Altium Limited
P10 = RES3: 卧贴
Q11 = SI7940DP
R34-R51 = RES2: 贴片电阻 5%
U7 = bq24171

## Sheet Sensor.SchDoc
size A2
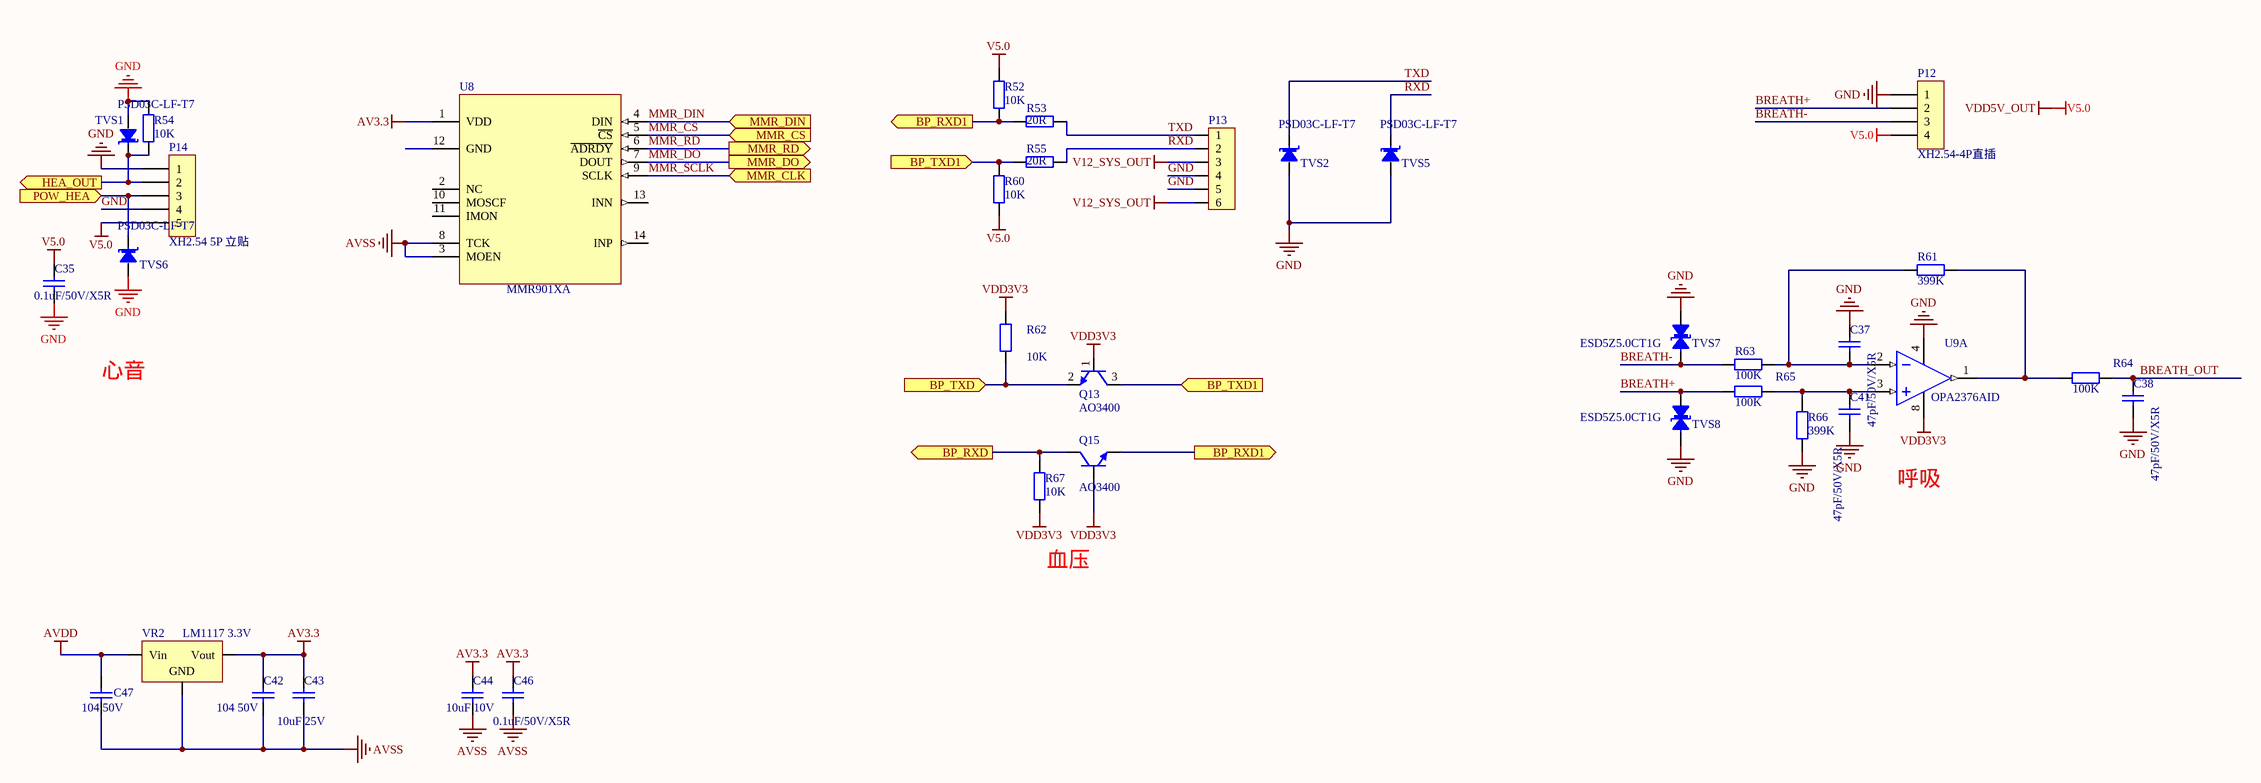
[diagram p5: Sensor.SchDoc]

### Parts
C35  0.1uF/50V/X5R  [SMD-0603C]
C37  47pF/50V/X5R  [SMD-0603C]
C38  47pF/50V/X5R  [SMD-0603C]
C41  47pF/50V/X5R  [SMD-0603C]
C42  104 50V  [SMD-0603C]
C43  10uF 25V  [SMD-0603C]
C44  10uF 10V  [SMD-0603C]
C46  0.1uF/50V/X5R  [SMD-0603C]
C47  104 50V  [SMD-0603C]
P12  XH2.54-4P直插  [4X2.54MMw]
P13  XH2.54 6P 立贴  [6X2.54MMW]  (value not drawn)
P14  XH2.54 5P 立贴  [5X2.54MMW]
Q13  AO3400  [SOT-23]
Q15  AO3400  [SOT-23]
R52  10K  [SMD-0603]
R53  20R  [SMD-0603]
R54  10K  [SMD-0603]
R55  20R  [SMD-0603]
R60  10K  [SMD-0603]
R61  399K  [SMD-0603]
R62  10K  [SMD-0603]
R63  100K  [SMD-0603]
R64  100K  [SMD-0603]
R65  100K  [SMD-0603]
R66  399K  [SMD-0603]
R67  10K  [SMD-0603]
TVS1  PSD03C-LF-T7  [SOD-323]
TVS2  PSD03C-LF-T7  [SOD-323]
TVS5  PSD03C-LF-T7  [SOD-323]
TVS6  PSD03C-LF-T7  [SOD-323]
TVS7  ESD5Z5.0CT1G  [SOD-523]
TVS8  ESD5Z5.0CT1G  [SOD-523]
U8  MMR901XA  [MMR901XA]
U9  OPA2376AID  [SOIC-8]  (part A of 2)
VR2  LM1117 3.3V  [SOT223]

### Ports
BP_RXD1 (out), BP_RXD (out), BP_TXD1 (in), BP_TXD (in), HEA_OUT (out), MMR_CLK (in), MMR_CS (in), MMR_DIN (in), MMR_DO (out), MMR_RD (out), POW_HEA (in)

### Nets
AV3.3: C42.2 C43.2 C44.2 C46.2 U8.1(VDD) VR2.2(Vout)
AVDD: C47.2 VR2.3(Vin)
AVSS: C42.1 C43.1 C44.1 C46.1 C47.1 U8.3(MOEN) U8.8(TCK) VR2.1(GND)
GND: C35.1 C37.2 C38.1 C41.1 P12.1 P13.4 P13.5 P14.1 P14.4 R54.1 R66.1 TVS1.1(A) TVS2.1(A) TVS5.1(A) TVS6.1(A) TVS7.1(A) TVS8.2(B) U9.4(V-)
V5.0: C35.2 P12.4 P14.5 R52.1 R60.2  [also labelled VDD5V_OUT]
V12_SYS_OUT: P13.3 P13.6
VDD3V3: Q13.1(B) Q15.1(B) R62.2 R67.1 U9.8(V+)
BREATH+: P12.2 R65.1 TVS8.1(A)
BREATH-: P12.3 R63.1 TVS7.2(B)
BREATH_OUT: C38.2 R64.2
MMR_CS: U8.5(~{CS}) ; port MMR_CS
MMR_DIN: U8.4(DIN) ; port MMR_DIN
MMR_DO: U8.7(DOUT) ; port MMR_DO
MMR_RD: U8.6(~{ADRDY}) ; port MMR_RD
MMR_SCLK: U8.9(SCLK) ; port MMR_CLK
RXD: P13.2 R55.1 TVS5.2(B)
TXD: P13.1 R53.1 TVS2.2(B)
NetC37_1: C37.1 R61.1 R63.2 U9.2(IN1-)
NetC41_2: C41.2 R65.2 R66.2 U9.3(IN1+)
NetP14_2: P14.2 R54.2 TVS1.2(B) ; port HEA_OUT
NetP14_3: P14.3 TVS6.2(B) ; port POW_HEA
NetQ13_2: Q13.2(E) R62.1 ; port BP_TXD
NetQ13_3: Q13.3(C) R55.2 R60.1 ; port BP_TXD1
NetQ15_2: Q15.2(E) R52.2 R53.2 ; port BP_RXD1
NetQ15_3: Q15.3(C) R67.2 ; port BP_RXD
NetR61_2: R61.2 R64.1 U9.1(OUT1)

Not connected (* = marked no-connect by the designer): U8 2(NC) 10(MOSCF) 11(IMON) 12(GND) 13(INN) 14(INP)

### Notes on the sheet
- 心音
- 呼吸
- (near R67) 血压

### Library data of the parts
C35 C43 C44 = CAP4: 贴片电容 20%
C37 C38 C41 C42 C46 C47 = CAP4: 贴片电容 10%
P12 = SIP-4
P13 = SIP-6: 血压计接口
P14 = SIP-5: 心音传感器接口
Q13 Q15 = NPN-1: NPN
R52-R55 R60-R67 = R: 贴片电阻 1%
TVS1 TVS2 TVS5 TVS6 = TVS-S: 单向TVS
TVS7 TVS8 = TVS-1: ESD二极管
U8 = MMR901: 压力传感器
U9 = LM358: 运放
VR2 = LM1117: 三端稳压器

## Nets that join several sheets
AVDD: cpu (P11.2), 02_Power (C11.2 C12.1 U2.6), Sensor (C47.2 VR2.3)
AVSS: cpu (P11.4), 02_Power (C11.1 C12.2 R72.1 U2.4), Sensor (8 pins)
GND: cpu (37 pins), BlueToothi (8 pins), 11_Speak (Q14.2 R59.2), 02_Power (32 pins), Charger (21 pins), Sensor (18 pins)
V5.0: cpu (P11.14), 11_Speak (R56.2), 02_Power (C9.1 Q4.3 U2.1), Sensor (5 pins)
V12: cpu (D7.2 D8.2 P22.1 P27.1), 02_Power (C6.2 C7.2 C8.1 F2.2), Charger (5 pins)
V12_SYS: 02_Power (5 pins), Charger (P9.2)
V12_SYS_OUT: 02_Power (Q2.3), Sensor (P13.3 P13.6)
VBAT: cpu (R180.1), Charger (12 pins)
VDD3V3: cpu (16 pins), BlueToothi (C17.2 Q18.2 R68.1), 02_Power (6 pins), Sensor (5 pins)
VDD3V3_OUT: cpu (P11.6), 02_Power (Q6.3)
VDD5V: cpu (6 pins), 02_Power (5 pins)
BDATA: cpu (U10.4), BlueToothi (U3.8)
BDISC: cpu (U10.7), BlueToothi (U3.6)
BLE_EN_3.3V: cpu (U10.37), BlueToothi (R70.1)
BLINK: cpu (U10.5), BlueToothi (U3.7)
BMOD: cpu (U10.9), BlueToothi (U3.4)
BREATH_OUT: cpu (U10.34), Sensor (C38.2 R64.2)
BRST: cpu (U10.35), BlueToothi (U3.22)
BRXD: cpu (U10.24), BlueToothi (U3.19)
BTXD: cpu (U10.23), BlueToothi (U3.18)
BWKP: cpu (U10.8), BlueToothi (U3.5)
MMR_CS: cpu (U10.71), Sensor (U8.5)
MMR_DIN: cpu (U10.32), Sensor (U8.4)
MMR_DO: cpu (U10.31), Sensor (U8.7)
MMR_RD: cpu (U10.1), Sensor (U8.6)
MMR_SCLK: cpu (U10.30), Sensor (U8.9)
NetP14_2: cpu (U10.29), Sensor (P14.2 R54.2 TVS1.2)
NetP14_3: cpu (U10.39), Sensor (P14.3 TVS6.2)
NetQ13_2: cpu (U10.25), Sensor (Q13.2 R62.1)
NetQ15_3: cpu (U10.26), Sensor (Q15.3 R67.2)
NetR57_1: cpu (U10.70), 11_Speak (R57.1)
POW_EN_3.3V: cpu (U10.97), 02_Power (R17.1)
POW_EN_5V: cpu (U10.41), 02_Power (R13.1)
PRESS_EN: cpu (U10.40), 02_Power (R4.1)
VBAT_STA: cpu (U10.17), Charger (LED2.2 U7.9)